# Altium project Using Snippets.PrjPcb
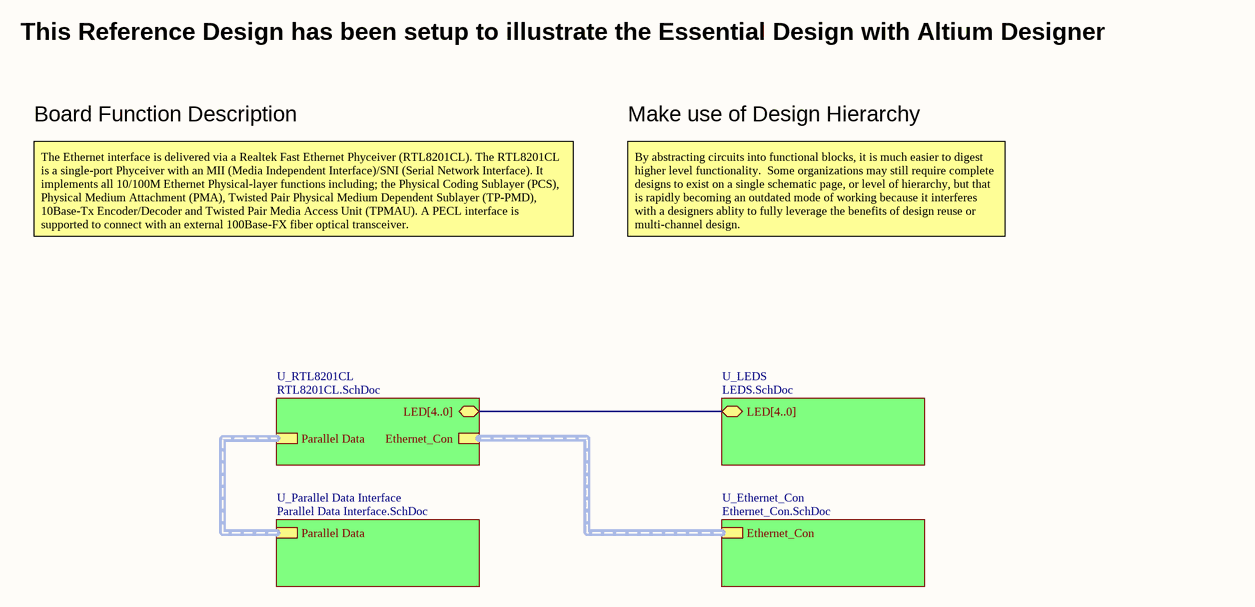
[diagram p0: PHY_Top.SchDoc]
5 sheets, 52 parts. Net scope: hierarchical (ports join the sheet entries above them; power ports are global).
Board file: Phy.PcbDoc
Sheets:
  PHY_Top.SchDoc
    U_Ethernet_Con = Ethernet_Con.SchDoc
    U_LEDS = LEDS.SchDoc
    U_Parallel Data Interface = Parallel Data Interface.SchDoc
    U_RTL8201CL = RTL8201CL.SchDoc

## Sheet PHY_Top.SchDoc: Using Snippets
size 431 x 279 mm

### Sub-sheets
U_Ethernet_Con = Ethernet_Con.SchDoc: Ethernet_Con (harness Con)
U_LEDS = LEDS.SchDoc: LED[4..0] (bidir)
U_Parallel Data Interface = Parallel Data Interface.SchDoc: Parallel Data (harness Parallel Data Sets)
U_RTL8201CL = RTL8201CL.SchDoc: LED[4..0] (bidir), Ethernet_Con (harness Con), Parallel Data (harness Parallel Data Sets)

### Buses and harness runs
bus sheet U_LEDS/LED[4..0] = sheet U_RTL8201CL/LED[4..0]
harness sheet U_Ethernet_Con/Ethernet_Con = sheet U_RTL8201CL/Ethernet_Con
harness sheet U_Parallel Data Interface/Parallel Data = sheet U_RTL8201CL/Parallel Data

### Notes on the sheet
- This Reference Design has been setup to illustrate the Essential Design with Altium Designer
- Board Function Description
- Make use of Design Hierarchy
- The Ethernet interface is delivered via a Realtek Fast Ethernet Phyceiver (RTL8201CL). The RTL8201CL is a single-port Phyceiver with an MII (Media Independent Interface)/SNI (Serial Network Interface). It implements all 10/100M Ethernet Physical-layer functions including; the Physical Coding Sublayer (PCS), Physical Medium Attachment (PMA), Twisted Pair Physical Medium Dependent Sublayer (TP-PMD), 10Base-Tx Encoder/Decoder and Twisted Pair Media Access Unit (TPMAU). A PECL interface is supported to connect with an external 100Base-FX fiber optical transceiver.
- By abstracting circuits into functional blocks, it is much easier to digest higher level functionality.  Some organizations may still require complete designs to exist on a single schematic page, or level of hierarchy, but that is rapidly becoming an outdated mode of working because it interferes with a designers ablity to fully leverage the benefits of design reuse or multi-channel design.
- 8
- 7
- 6
- 5
- 4
- 3
- DWG. NO.
- REV.
- SHT.
- 2
- 1
- THIS DOCUMENT AND THE DATA DISCLOSED HEREIN OR HEREWITH IS THE PROPERTY OF ALTIUM LIMITED AND MAY BE FREELY DISTRIBUTED IN WHOLE. NO RIGHTS ARE RESERVED OR EXPRESS OR IMPLIED WARANTEE GIVEN.
- REVISION
- DESCRIPTION
- DATE
- APPROVED
- F
- E
- D
- C
- B
- ENG:
- APPROVALS
- PROJECT
- A
- DSN:
- CHK:
- REFERENCE DOCUMENTS
- PROJECT REVISION:
- TITLE
- DOCUMENT REVISION:
- DESIGN ITEM:
- BOM:
- FAB DWG:
- PCB DWG:
- ASSY DWG:
- SCALE:
- SIZE
- CAGE CODE
- FILE NAME
- DWG NO.
- SHEET
- OF
- REV

## Sheet Ethernet_Con.SchDoc: Using Snippets
size 431 x 279 mm
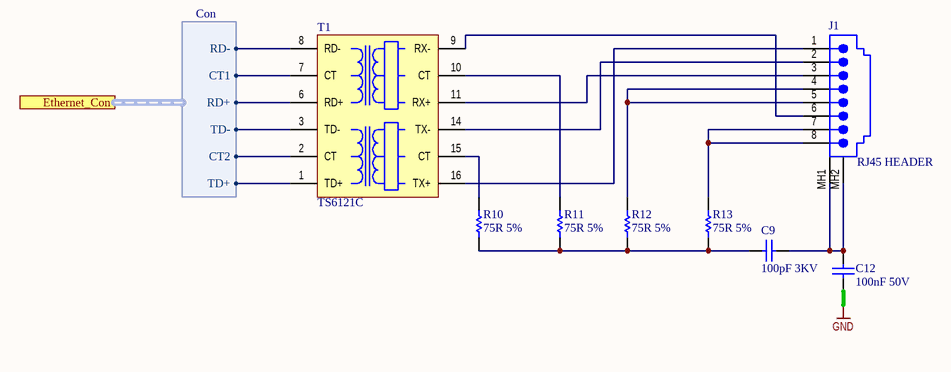
[diagram p1: Ethernet_Con.SchDoc]

### Parts
C9  100pF 3KV  [CAPR7_5-3_6x7_5]
C12  100nF 50V  [CAPC2012]
J1  RJ45 HEADER  [95122-2881]
R10  75R 5%  [RESC2012]
R11  75R 5%  [RESC2012]
R12  75R 5%  [RESC2012]
R13  75R 5%  [RESC2012]
T1  TS6121C  [SOIC127P910-16]

### Ports
Ethernet_Con (harness Con)

### Harnesses
Con: RD-, CT1, RD+, TD-, CT2, TD+

### Nets
GND: C12.1
NetC6_2: T1.7(CT) ; port Ethernet_Con.CT1
NetC9_1: C9.1 R10.2 R11.2 R12.2 R13.2
NetC9_2: C9.2 C12.2 J1.MH1(Shield) J1.MH2(Shield)
NetC11_2: T1.2(CT) ; port Ethernet_Con.CT2
NetJ1_1: J1.1 T1.16(TX+)
NetJ1_2: J1.2 T1.14(TX-)
NetJ1_3: J1.3 T1.11(RX+)
NetJ1_4: J1.4 J1.5 R12.1
NetJ1_6: J1.6 T1.9(RX-)
NetJ1_7: J1.7 J1.8 R13.1
NetR2_1: T1.6(RD+) ; port Ethernet_Con.RD+
NetR3_1: T1.8(RD-) ; port Ethernet_Con.RD-
NetR5_2: T1.3(TD-) ; port Ethernet_Con.TD-
NetR6_2: T1.1(TD+) ; port Ethernet_Con.TD+
NetR10_1: R10.1 T1.15(CT)
NetR11_1: R11.1 T1.10(CT)

### Notes on the sheet
- 8
- 7
- 6
- 5
- 4
- 3
- DWG. NO.
- REV.
- SHT.
- 2
- 1
- THIS DOCUMENT AND THE DATA DISCLOSED HEREIN OR HEREWITH IS THE PROPERTY OF ALTIUM LIMITED AND MAY BE FREELY DISTRIBUTED IN WHOLE. NO RIGHTS ARE RESERVED OR EXPRESS OR IMPLIED WARANTEE GIVEN.
- REVISION
- DESCRIPTION
- DATE
- APPROVED
- F
- E
- D
- C
- B
- ENG:
- APPROVALS
- PROJECT
- A
- DSN:
- CHK:
- REFERENCE DOCUMENTS
- PROJECT REVISION:
- TITLE
- DOCUMENT REVISION:
- DESIGN ITEM:
- BOM:
- FAB DWG:
- PCB DWG:
- ASSY DWG:
- SCALE:
- SIZE
- CAGE CODE
- FILE NAME
- DWG NO.
- SHEET
- OF
- REV

### Library data of the parts
C9 C12 = CAP-NP: Capacitor
J1 = CON-RJ45-10-RA: Right Angle, Standard Profile, External Shield PCB Jack
R10-R13 = RES: Resistor
T1 = TS6121C: Bothhand 10/100 BaseT Pulse Transformer

## Sheet LEDS.SchDoc: Using Snippets
size 431 x 279 mm
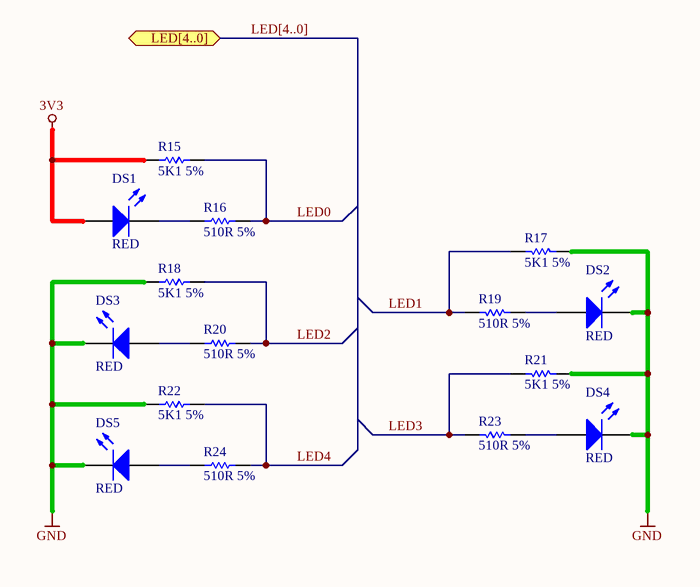
[diagram p2: LEDS.SchDoc]

### Parts
DS1  RED  [LED2013]
DS2  RED  [LED2013]
DS3  RED  [LED2013]
DS4  RED  [LED2013]
DS5  RED  [LED2013]
R15  5K1 5%  [RESC2012]
R16  510R 5%  [RESC2012]
R17  5K1 5%  [RESC2012]
R18  5K1 5%  [RESC2012]
R19  510R 5%  [RESC2012]
R20  510R 5%  [RESC2012]
R21  5K1 5%  [RESC2012]
R22  5K1 5%  [RESC2012]
R23  510R 5%  [RESC2012]
R24  510R 5%  [RESC2012]

### Ports
LED[4..0] (bidir)

### Nets
3V3: DS1.1(A) R15.1
GND: DS2.2(K) DS3.2(K) DS4.2(K) DS5.2(K) R17.1 R18.1 R21.1 R22.1
LED0: R15.2 R16.2
LED1: R17.2 R19.2
LED2: R18.2 R20.2
LED3: R21.2 R23.2
LED4: R22.2 R24.2
NetDS1_2: DS1.2(K) R16.1
NetDS2_1: DS2.1(A) R19.1
NetDS3_1: DS3.1(A) R20.1
NetDS4_1: DS4.1(A) R23.1
NetDS5_1: DS5.1(A) R24.1

### Buses and harness runs
bus LED[4..0] = port LED[4..0]

### Notes on the sheet
- 8
- 7
- 6
- 5
- 4
- 3
- DWG. NO.
- REV.
- SHT.
- 2
- 1
- THIS DOCUMENT AND THE DATA DISCLOSED HEREIN OR HEREWITH IS THE PROPERTY OF ALTIUM LIMITED AND MAY BE FREELY DISTRIBUTED IN WHOLE. NO RIGHTS ARE RESERVED OR EXPRESS OR IMPLIED WARANTEE GIVEN.
- REVISION
- DESCRIPTION
- DATE
- APPROVED
- F
- E
- D
- C
- B
- ENG:
- APPROVALS
- PROJECT
- A
- DSN:
- CHK:
- REFERENCE DOCUMENTS
- PROJECT REVISION:
- TITLE
- DOCUMENT REVISION:
- DESIGN ITEM:
- BOM:
- FAB DWG:
- PCB DWG:
- ASSY DWG:
- SCALE:
- SIZE
- CAGE CODE
- FILE NAME
- DWG NO.
- SHEET
- OF
- REV

### Library data of the parts
DS1-DS5 = DIO-LED-1S: Typical GREEN SMD LED Agilent make
R15-R24 = RES: Resistor

## Sheet Parallel Data Interface.SchDoc: Using Snippets
size 431 x 279 mm
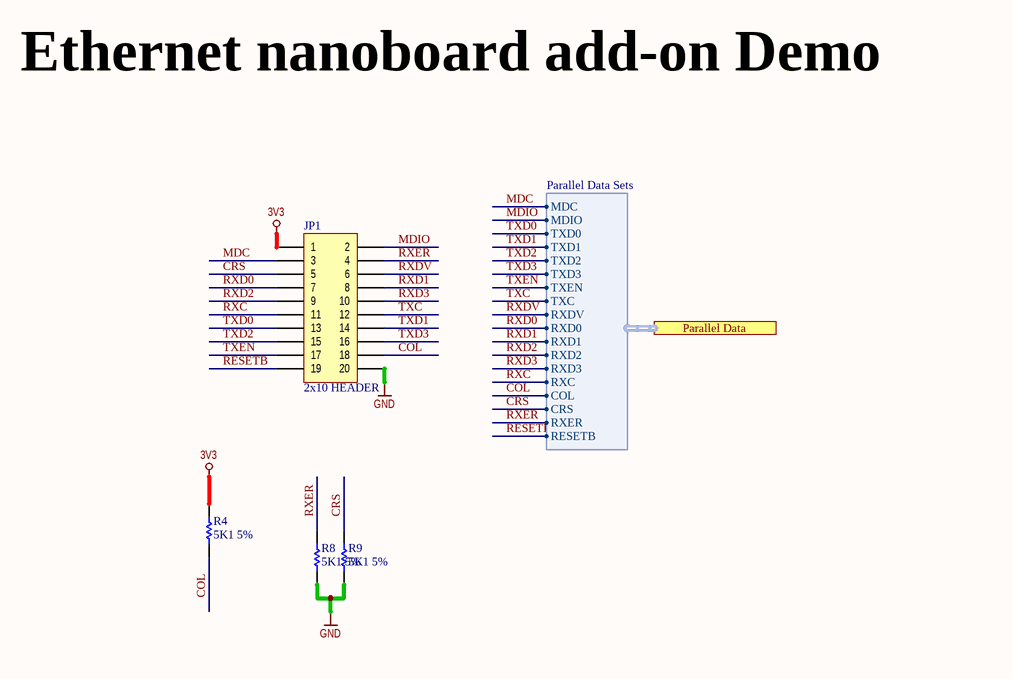
[diagram p3: Parallel Data Interface.SchDoc]

### Parts
JP1  2x10 HEADER  [HDR2X10]
R4  5K1 5%  [RESC2012]
R8  5K1 5%  [RESC2012]
R9  5K1 5%  [RESC2012]

### Ports
Parallel Data (harness Parallel Data Sets)

### Harnesses
Parallel Data Sets: MDC, MDIO, TXD0, TXD1, TXD2, TXD3, TXEN, TXC, RXDV, RXD0, RXD1, RXD2, RXD3, RXC, COL, CRS, RXER, RESETB

### Nets
3V3: JP1.1 R4.2
GND: JP1.20 R8.1 R9.1
COL: JP1.18 R4.1 ; port Parallel Data.COL
CRS: JP1.5 R9.2 ; port Parallel Data.CRS
MDC: JP1.3 ; port Parallel Data.MDC
MDIO: JP1.2 ; port Parallel Data.MDIO
RESETB: JP1.19 ; port Parallel Data.RESETB
RXC: JP1.11 ; port Parallel Data.RXC
RXD0: JP1.7 ; port Parallel Data.RXD0
RXD1: JP1.8 ; port Parallel Data.RXD1
RXD2: JP1.9 ; port Parallel Data.RXD2
RXD3: JP1.10 ; port Parallel Data.RXD3
RXDV: JP1.6 ; port Parallel Data.RXDV
RXER: JP1.4 R8.2 ; port Parallel Data.RXER
TXC: JP1.12 ; port Parallel Data.TXC
TXD0: JP1.13 ; port Parallel Data.TXD0
TXD1: JP1.14 ; port Parallel Data.TXD1
TXD2: JP1.15 ; port Parallel Data.TXD2
TXD3: JP1.16 ; port Parallel Data.TXD3
TXEN: JP1.17 ; port Parallel Data.TXEN

### Notes on the sheet
- Ethernet nanoboard add-on Demo
- 8
- 7
- 6
- 5
- 4
- 3
- DWG. NO.
- REV.
- SHT.
- 2
- 1
- THIS DOCUMENT AND THE DATA DISCLOSED HEREIN OR HEREWITH IS THE PROPERTY OF ALTIUM LIMITED AND MAY BE FREELY DISTRIBUTED IN WHOLE. NO RIGHTS ARE RESERVED OR EXPRESS OR IMPLIED WARANTEE GIVEN.
- REVISION
- DESCRIPTION
- DATE
- APPROVED
- F
- E
- D
- C
- B
- ENG:
- APPROVALS
- PROJECT
- A
- DSN:
- CHK:
- REFERENCE DOCUMENTS
- PROJECT REVISION:
- TITLE
- DOCUMENT REVISION:
- DESIGN ITEM:
- BOM:
- FAB DWG:
- PCB DWG:
- ASSY DWG:
- SCALE:
- SIZE
- CAGE CODE
- FILE NAME
- DWG NO.
- SHEET
- OF
- REV

### Library data of the parts
JP1 = CON-HDR-2x10-STR: Header, 10-Pin, Dual row
R4 R8 R9 = RES: Resistor

## Sheet RTL8201CL.SchDoc: Using Snippets
size 431 x 279 mm; DocumentNumber: 1; SheetNumber: 1; SheetTotal: 1
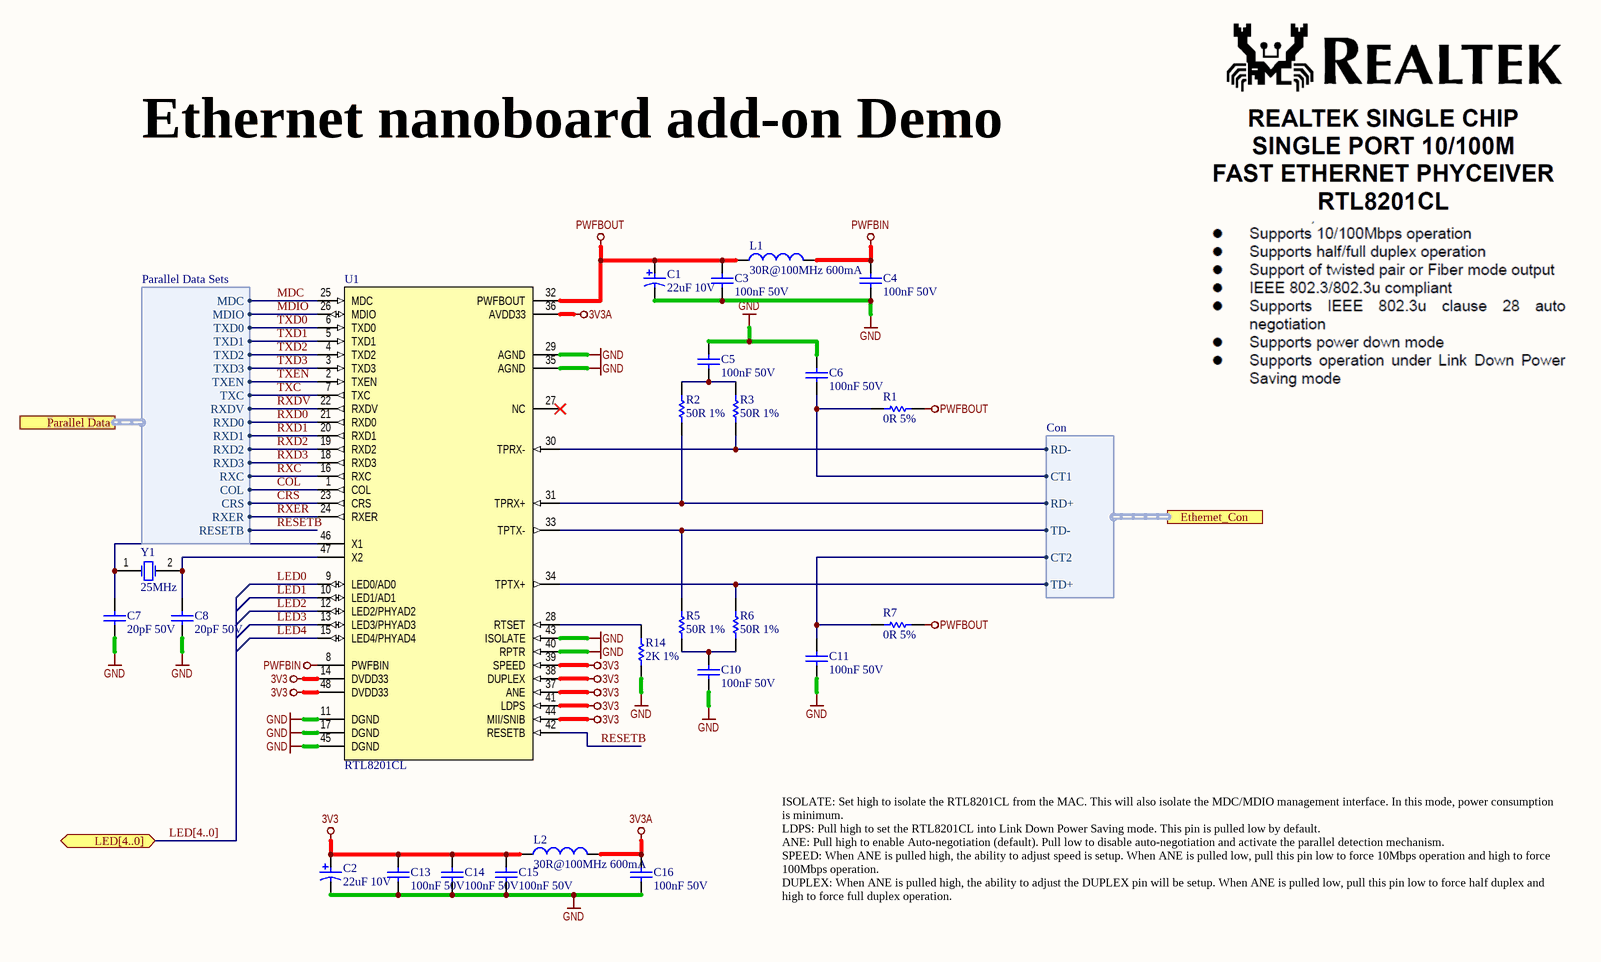
[diagram p4: RTL8201CL.SchDoc]

### Parts
C1  22uF 10V  [CAPC3528]
C2  22uF 10V  [CAPC3528]
C3  100nF 50V  [CAPC2012]
C4  100nF 50V  [CAPC2012]
C5  100nF 50V  [CAPC2012]
C6  100nF 50V  [CAPC2012]
C7  20pF 50V  [CAPC2012]
C8  20pF 50V  [CAPC2012]
C10  100nF 50V  [CAPC2012]
C11  100nF 50V  [CAPC2012]
C13  100nF 50V  [CAPC2012]
C14  100nF 50V  [CAPC2012]
C15  100nF 50V  [CAPC2012]
C16  100nF 50V  [CAPC2012]
L1  30R@100MHz 600mA  [INDC2012]
L2  30R@100MHz 600mA  [INDC2012]
R1  0R 5%  [RESC2012]
R2  50R 1%  [RESC2012]
R3  50R 1%  [RESC2012]
R5  50R 1%  [RESC2012]
R6  50R 1%  [RESC2012]
R7  0R 5%  [RESC2012]
R14  2K 1%  [RESC2012]
U1  RTL8201CL  [TSQFP50P900X900-48]
Y1  25MHz  [XTAL_HC49SMD 20Mhz  +/-30ppm 20pf]

### Ports
Ethernet_Con (harness Con), LED[4..0] (bidir), Parallel Data (harness Parallel Data Sets)

### Harnesses
Con: RD-, CT1, RD+, TD-, CT2, TD+
Parallel Data Sets: MDC, MDIO, TXD0, TXD1, TXD2, TXD3, TXEN, TXC, RXDV, RXD0, RXD1, RXD2, RXD3, RXC, COL, CRS, RXER, RESETB

### Nets
3V3: C2.1 C13.2 C14.2 C15.2 L2.1 U1.14(DVDD33) U1.37(ANE) U1.38(DUPLEX) U1.39(SPEED) U1.41(LDPS) U1.44(MII/SNIB) U1.48(DVDD33)
3V3A: C16.2 L2.2 U1.36(AVDD33)
GND: C1.2 C2.2 C3.1 C4.1 C5.2 C6.1 C7.1 C8.1 C10.1 C11.1 C13.1 C14.1 C15.1 C16.1 R14.1 U1.11(DGND) U1.17(DGND) U1.29(AGND) U1.35(AGND) U1.40(RPTR) U1.43(ISOLATE) U1.45(DGND)
PWFBIN: C4.2 L1.2 U1.8(PWFBIN)
PWFBOUT: C1.1 C3.2 L1.1 R1.2 R7.2 U1.32(PWFBOUT)
COL: U1.1(COL) ; port Parallel Data.COL
CRS: U1.23(CRS) ; port Parallel Data.CRS
LED0: U1.9(LED0/AD0)
LED1: U1.10(LED1/AD1)
LED2: U1.12(LED2/PHYAD2)
LED3: U1.13(LED3/PHYAD3)
LED4: U1.15(LED4/PHYAD4)
MDC: U1.25(MDC) ; port Parallel Data.MDC
MDIO: U1.26(MDIO) ; port Parallel Data.MDIO
RESETB: U1.42(RESETB) ; port Parallel Data.RESETB
RXC: U1.16(RXC) ; port Parallel Data.RXC
RXD0: U1.21(RXD0) ; port Parallel Data.RXD0
RXD1: U1.20(RXD1) ; port Parallel Data.RXD1
RXD2: U1.19(RXD2) ; port Parallel Data.RXD2
RXD3: U1.18(RXD3) ; port Parallel Data.RXD3
RXDV: U1.22(RXDV) ; port Parallel Data.RXDV
RXER: U1.24(RXER) ; port Parallel Data.RXER
TXC: U1.7(TXC) ; port Parallel Data.TXC
TXD0: U1.6(TXD0) ; port Parallel Data.TXD0
TXD1: U1.5(TXD1) ; port Parallel Data.TXD1
TXD2: U1.4(TXD2) ; port Parallel Data.TXD2
TXD3: U1.3(TXD3) ; port Parallel Data.TXD3
TXEN: U1.2(TXEN) ; port Parallel Data.TXEN
NetC5_1: C5.1 R2.2 R3.2
NetC6_2: C6.2 R1.1 ; port Ethernet_Con.CT1
NetC7_2: C7.2 U1.46(X1) Y1.1(OSC1)
NetC8_2: C8.2 U1.47(X2) Y1.2(OSC2)
NetC10_2: C10.2 R5.1 R6.1
NetC11_2: C11.2 R7.1 ; port Ethernet_Con.CT2
NetR2_1: R2.1 U1.31(TPRX+) ; port Ethernet_Con.RD+
NetR3_1: R3.1 U1.30(TPRX-) ; port Ethernet_Con.RD-
NetR5_2: R5.2 U1.33(TPTX-) ; port Ethernet_Con.TD-
NetR6_2: R6.2 U1.34(TPTX+) ; port Ethernet_Con.TD+
NetR14_2: R14.2 U1.28(RTSET)

Not connected (* = marked no-connect by the designer): U1 27(NC)*

### Buses and harness runs
bus LED[4..0] = port LED[4..0]

### Notes on the sheet
- Ethernet nanoboard add-on Demo
- ISOLATE: Set high to isolate the RTL8201CL from the MAC. This will also isolate the MDC/MDIO management interface. In this mode, power consumption is minimum.
  LDPS: Pull high to set the RTL8201CL into Link Down Power Saving mode. This pin is pulled low by default.
  ANE: Pull high to enable Auto-negotiation (default). Pull low to disable auto-negotiation and activate the parallel detection mechanism.
  SPEED: When ANE is pulled high, the ability to adjust speed is setup. When ANE is pulled low, pull this pin low to force 10Mbps operation and high to force 100Mbps operation.
  DUPLEX: When ANE is pulled high, the ability to adjust the DUPLEX pin will be setup. When ANE is pulled low, pull this pin low to force half duplex and high to force full duplex operation.
- 8
- 7
- 6
- 5
- 4
- 3
- DWG. NO.
- REV.
- SHT.
- 2
- 1
- THIS DOCUMENT AND THE DATA DISCLOSED HEREIN OR HEREWITH IS THE PROPERTY OF ALTIUM LIMITED AND MAY BE FREELY DISTRIBUTED IN WHOLE. NO RIGHTS ARE RESERVED OR EXPRESS OR IMPLIED WARANTEE GIVEN.
- REVISION
- DESCRIPTION
- DATE
- APPROVED
- F
- E
- D
- C
- B
- ENG:
- APPROVALS
- PROJECT
- A
- DSN:
- CHK:
- REFERENCE DOCUMENTS
- PROJECT REVISION:
- TITLE
- DOCUMENT REVISION:
- DESIGN ITEM:
- BOM:
- FAB DWG:
- PCB DWG:
- ASSY DWG:
- SCALE:
- SIZE
- CAGE CODE
- FILE NAME
- DWG NO.
- SHEET
- OF
- REV

### Library data of the parts
C1 C2 = CAP-P: Polar Capacitor
C3-C8 C10 C11 C13-C16 = CAP-NP: Capacitor
L1 L2 = IND-FER: Ferrite Bead
R1-R3 R5-R7 R14 = RES: Resistor
U1 = RTL8201CL: Realtek Ethernet PHY tranceiver
Y1 = CRYS: Surface Mount Crystal

## Nets that join several sheets
3V3: LEDS (DS1.1 R15.1), Parallel Data Interface (JP1.1 R4.2), RTL8201CL (12 pins)
GND: Ethernet_Con (C12.1), LEDS (8 pins), Parallel Data Interface (JP1.20 R8.1 R9.1), RTL8201CL (22 pins)
COL: Parallel Data Interface (JP1.18 R4.1), RTL8201CL (U1.1)
CRS: Parallel Data Interface (JP1.5 R9.2), RTL8201CL (U1.23)
LED0: LEDS (R15.2 R16.2), RTL8201CL (U1.9)
LED1: LEDS (R17.2 R19.2), RTL8201CL (U1.10)
LED2: LEDS (R18.2 R20.2), RTL8201CL (U1.12)
LED3: LEDS (R21.2 R23.2), RTL8201CL (U1.13)
LED4: LEDS (R22.2 R24.2), RTL8201CL (U1.15)
MDC: Parallel Data Interface (JP1.3), RTL8201CL (U1.25)
MDIO: Parallel Data Interface (JP1.2), RTL8201CL (U1.26)
NetC6_2: Ethernet_Con (T1.7), RTL8201CL (C6.2 R1.1)
NetC11_2: Ethernet_Con (T1.2), RTL8201CL (C11.2 R7.1)
NetR2_1: Ethernet_Con (T1.6), RTL8201CL (R2.1 U1.31)
NetR3_1: Ethernet_Con (T1.8), RTL8201CL (R3.1 U1.30)
NetR5_2: Ethernet_Con (T1.3), RTL8201CL (R5.2 U1.33)
NetR6_2: Ethernet_Con (T1.1), RTL8201CL (R6.2 U1.34)
RESETB: Parallel Data Interface (JP1.19), RTL8201CL (U1.42)
RXC: Parallel Data Interface (JP1.11), RTL8201CL (U1.16)
RXD0: Parallel Data Interface (JP1.7), RTL8201CL (U1.21)
RXD1: Parallel Data Interface (JP1.8), RTL8201CL (U1.20)
RXD2: Parallel Data Interface (JP1.9), RTL8201CL (U1.19)
RXD3: Parallel Data Interface (JP1.10), RTL8201CL (U1.18)
RXDV: Parallel Data Interface (JP1.6), RTL8201CL (U1.22)
RXER: Parallel Data Interface (JP1.4 R8.2), RTL8201CL (U1.24)
TXC: Parallel Data Interface (JP1.12), RTL8201CL (U1.7)
TXD0: Parallel Data Interface (JP1.13), RTL8201CL (U1.6)
TXD1: Parallel Data Interface (JP1.14), RTL8201CL (U1.5)
TXD2: Parallel Data Interface (JP1.15), RTL8201CL (U1.4)
TXD3: Parallel Data Interface (JP1.16), RTL8201CL (U1.3)
TXEN: Parallel Data Interface (JP1.17), RTL8201CL (U1.2)